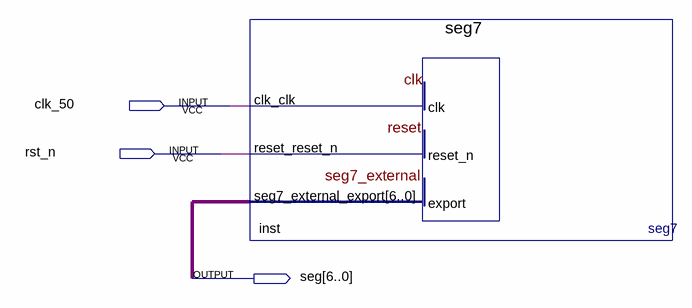
[diagram p0: schematic sheet]
// Quartus schematic Segs_sopc.bdf as structural Verilog: 1 symbols, 3 pins
module Segs_sopc (
  input  clk_50,
  input  rst_n,
  output [6:0] seg
);

  seg7 inst (.clk_clk(clk_50), .reset_reset_n(rst_n), .seg7_external_export(seg));
endmodule
